# Altium schematic sheet MCU.SchDoc
size A4
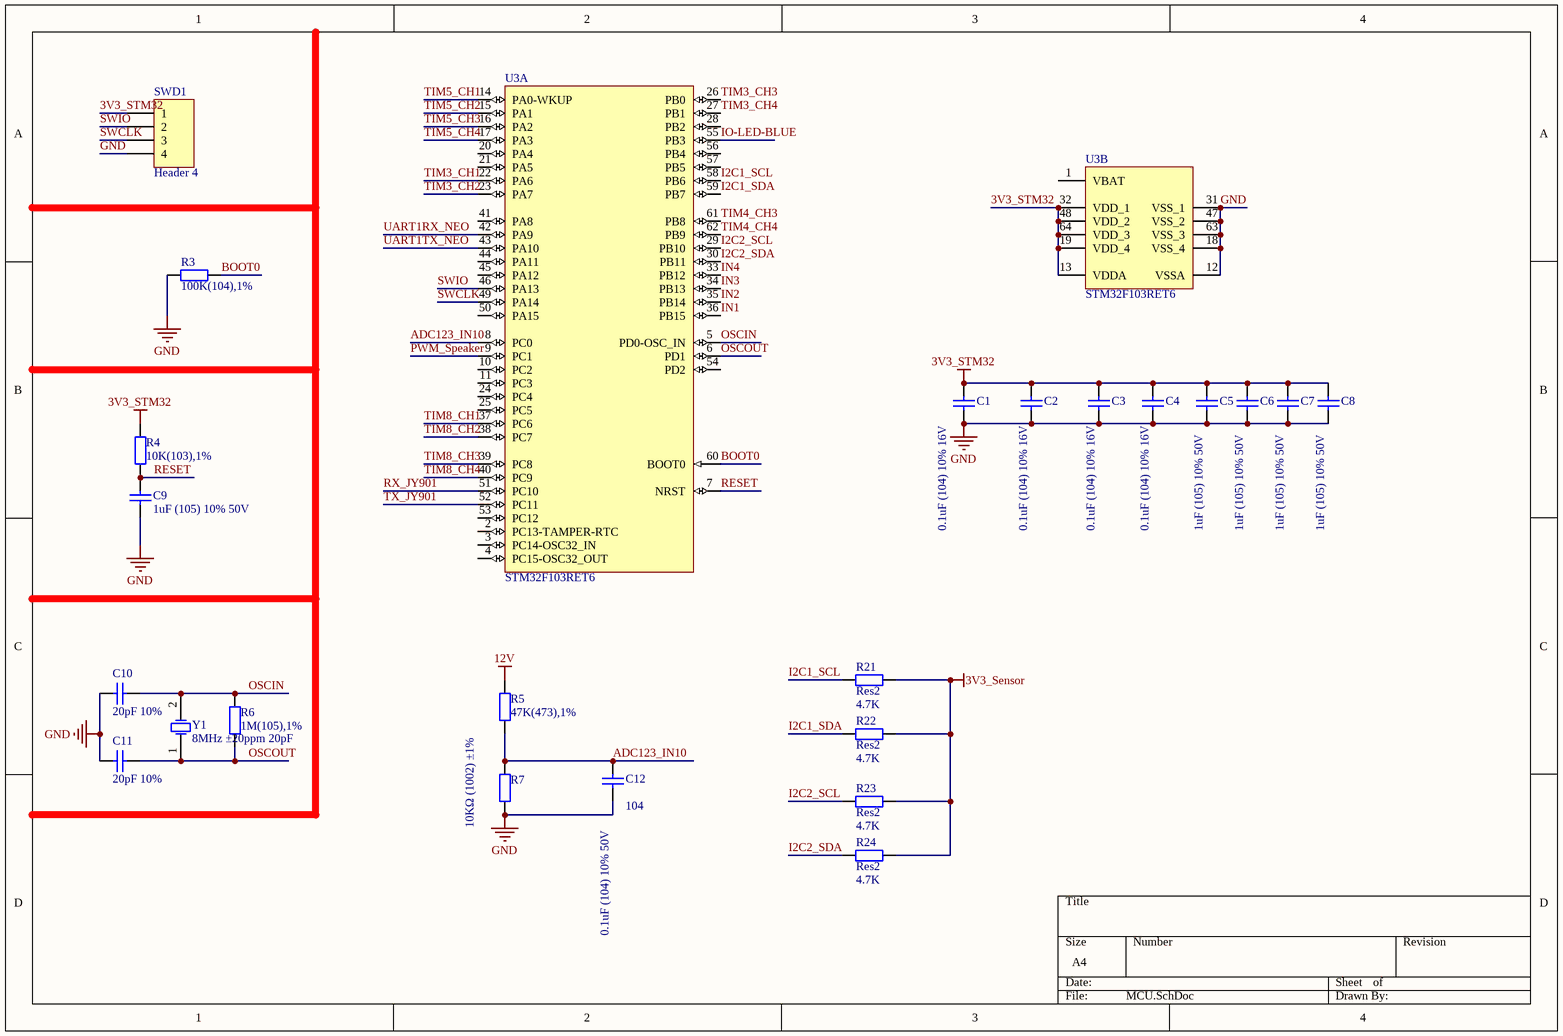
[diagram p0: MCU.SchDoc]

## Parts
C1  0.1uF (104) 10% 16V  [0603_C]
C2  0.1uF (104) 10% 16V  [0603_C]
C3  0.1uF (104) 10% 16V  [0603_C]
C4  0.1uF (104) 10% 16V  [0603_C]
C5  1uF (105) 10% 50V  [0603_C]
C6  1uF (105) 10% 50V  [0603_C]
C7  1uF (105) 10% 50V  [0603_C]
C8  1uF (105) 10% 50V  [0603_C]
C9  1uF (105) 10% 50V  [0603_C]
C10  20pF 10%  [0603_C]
C11  20pF 10%  [0603_C]
C12  0.1uF (104) 10% 50V  value 104  [0603_C]
R3  100K(104),1%  [0603_R]
R4  10K(103),1%  [0603_R]
R5  47K(473),1%  [0603_R]
R6  1M(105),1%  [0603_R]
R7  10KΩ (1002) ±1%  [0603_R]
R21  Res2  value 4.7K  [R0603]
R22  Res2  value 4.7K  [R0603]
R23  Res2  value 4.7K  [R0603]
R24  Res2  value 4.7K  [R0603]
SWD1  Header 4  [HDR1X4]
U3  STM32F103RET6  [LQFP-64_10x10x05P]  (parts A,B of 2)
Y1  8MHz ±20ppm 20pF  [SMD-5032_2P]

## Nets
3V3_Sensor: R21.2 R22.2 R23.2 R24.2
3V3_STM32: C1.2 C2.2 C3.2 C4.2 C5.2 C6.2 C7.2 C8.2 R4.2 SWD1.1 U3.13(VDDA) U3.19(VDD_4) U3.32(VDD_1) U3.48(VDD_2) U3.64(VDD_3)
12V: R5.2
GND: C1.1 C2.1 C3.1 C4.1 C5.1 C6.1 C7.1 C8.1 C9.1 C10.2 C11.2 C12.1 R3.1 R7.1 SWD1.4 U3.12(VSSA) U3.18(VSS_4) U3.31(VSS_1) U3.47(VSS_2) U3.63(VSS_3)
ADC123_IN10: C12.2 R5.1 R7.2 U3.8(PC0)
BOOT0: R3.2 U3.60(BOOT0)
I2C1_SCL: R21.1 U3.58(PB6)
I2C1_SDA: R22.1 U3.59(PB7)
I2C2_SCL: R23.1 U3.29(PB10)
I2C2_SDA: R24.1 U3.30(PB11)
IN1: U3.36(PB15)
IN2: U3.35(PB14)
IN3: U3.34(PB13)
IN4: U3.33(PB12)
IO-LED-BLUE: U3.55(PB3)
OSCIN: C10.1 R6.2 U3.5(PD0-OSC_IN) Y1.2(OSC2)
OSCOUT: C11.1 R6.1 U3.6(PD1) Y1.1(OSC1)
PWM_Speaker: U3.9(PC1)
RESET: C9.2 R4.1 U3.7(NRST)
RX_JY901: U3.51(PC10)
SWCLK: SWD1.3 U3.49(PA14)
SWIO: SWD1.2 U3.46(PA13)
TIM3_CH1: U3.22(PA6)
TIM3_CH2: U3.23(PA7)
TIM3_CH3: U3.26(PB0)
TIM3_CH4: U3.27(PB1)
TIM4_CH3: U3.61(PB8)
TIM4_CH4: U3.62(PB9)
TIM5_CH1: U3.14(PA0-WKUP)
TIM5_CH2: U3.15(PA1)
TIM5_CH3: U3.16(PA2)
TIM5_CH4: U3.17(PA3)
TIM8_CH1: U3.37(PC6)
TIM8_CH2: U3.38(PC7)
TIM8_CH3: U3.39(PC8)
TIM8_CH4: U3.40(PC9)
TX_JY901: U3.52(PC11)
UART1RX_NEO: U3.42(PA9)
UART1TX_NEO: U3.43(PA10)

Not connected (* = marked no-connect by the designer): U3 1(VBAT) 2(PC13-TAMPER-RTC) 3(PC14-OSC32_IN) 4(PC15-OSC32_OUT) 10(PC2) 11(PC3) 20(PA4) 21(PA5) 24(PC4) 25(PC5) 28(PB2) 41(PA8) 44(PA11) 45(PA12) 50(PA15) 53(PC12) 54(PD2) 56(PB4) 57(PB5)

## Library data of the parts
C1-C4 C10 C11 = Cap: Capacitor; Value: 104; Published: 8-Jun-2000; LatestRevisionDate: 17-Jul-2002; LatestRevisionNote: Re-released for DXP Platform.; Publisher: Altium Limited
C5-C8 = 0603 1uF (105) 10% 50V: 贴片电容; ComponentLink1Description: 供应商链接; ComponentLink1URL: http://www.szlcsc.com/product/details_16531.html; Package: 0603; Supplier: LC; SuppliersPartNumber: C15849
C9 = Cap: Capacitor; Value: 105; Published: 8-Jun-2000; LatestRevisionDate: 17-Jul-2002; LatestRevisionNote: Re-released for DXP Platform.; Publisher: Altium Limited
C12 = Cap: Capacitor; Published: 8-Jun-2000; LatestRevisionDate: 17-Jul-2002; LatestRevisionNote: Re-released for DXP Platform.; PackageReference: RAD-0.3; Publisher: Altium Limited; PackageDescription: Radial Cap, Thru-Hole; 2 Leads; 0.3 in Pin Spacing
R3-R6 R21-R24 = Res2: Resistor; Published: 8-Jun-2000; LatestRevisionDate: 17-Jul-2002; LatestRevisionNote: Re-released for DXP Platform.; Publisher: Altium Limited
  R21-R24: PackageReference: AXIAL-0.4; PackageDescription: Axial Device, Thru-Hole; 2 Leads; 0.4 in Pin Spacing
R7 = 0603 10KΩ (1002) 1%: 贴片电阻; ComponentLink1Description: 供应商链接; ComponentLink1URL: http://www.szlcsc.com/product/details_26547.html; Package: 0603; Supplier: LC; SuppliersPartNumber: C25804
SWD1 = Header 4: Header, 4-Pin; LatestRevisionDate: 17-Jul-2002; LatestRevisionNote: Re-released for DXP Platform.; Publisher: Altium Limited
U3 = STM32F103RET6: ARM; ComponentLink1Description: 供应商链接; ComponentLink1URL: http://www.szlcsc.com/product/details_8814.html; Package: LQFP-64_10x10x05P; Supplier: LC; SuppliersPartNumber: C8322
Y1 = SMD-5032_2P 8MHz 20ppm 20pF: 贴片晶振; ComponentLink1Description: 供应商链接; ComponentLink1URL: http://www.szlcsc.com/product/details_19261.html; Package: SMD-5032_2P; Supplier: LC; SuppliersPartNumber: C18560